# Altium project SwarmRobotPCB.PrjPcb
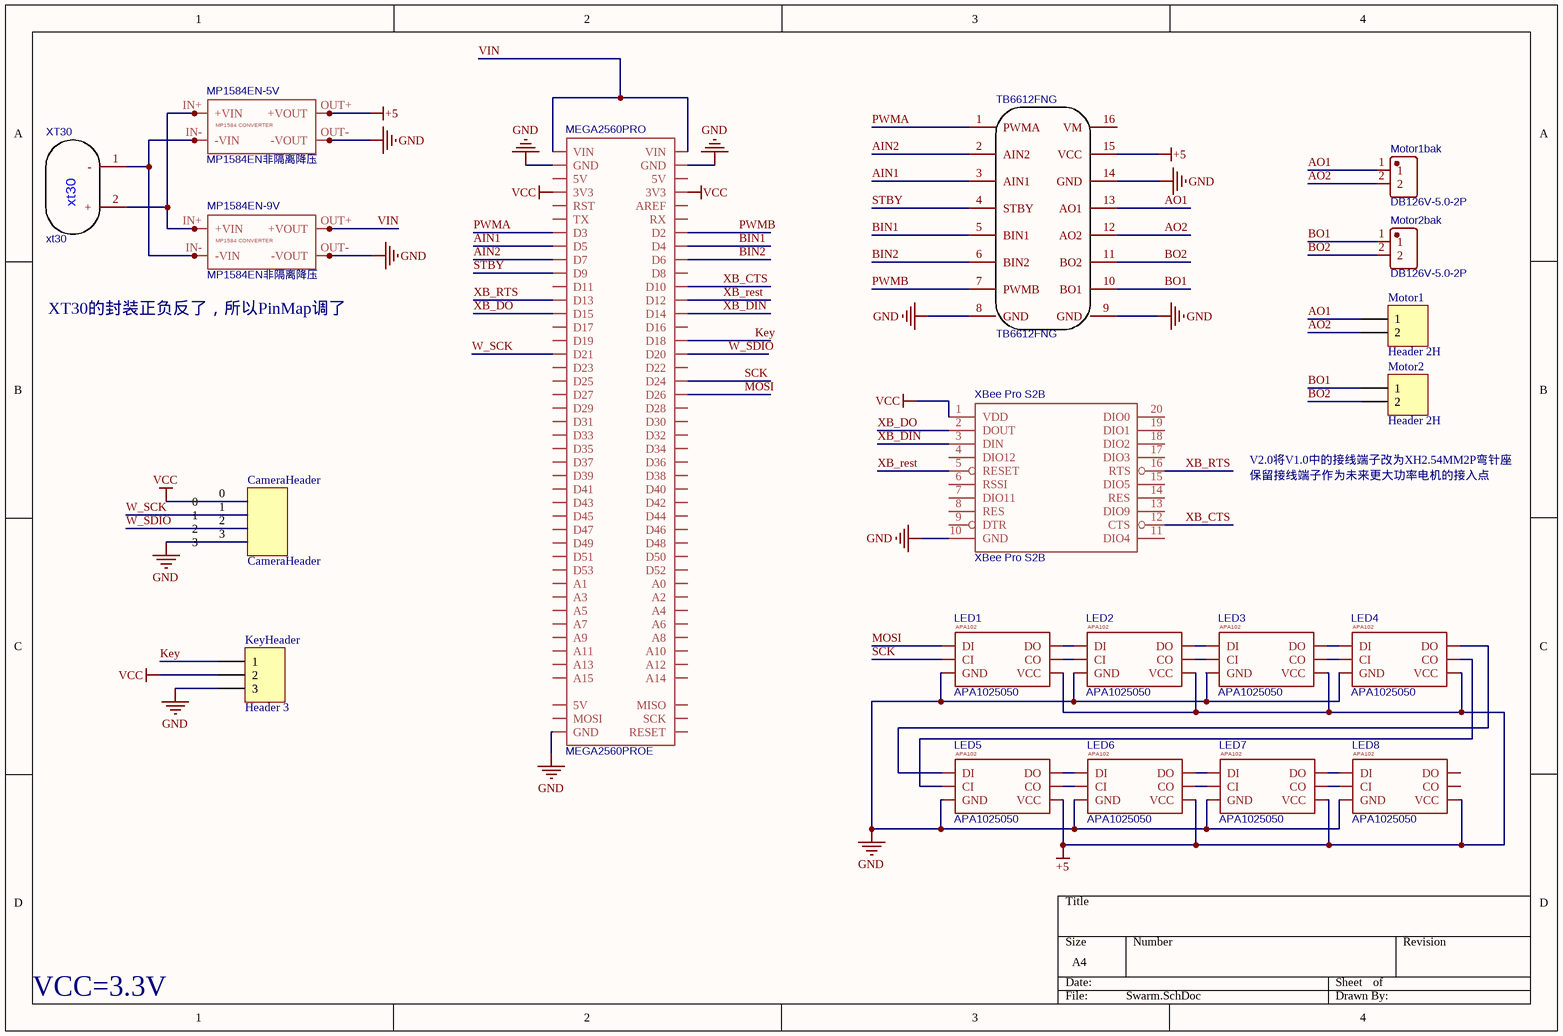
[diagram p0: Swarm.SchDoc]
1 sheet, 20 parts. Net scope: global (net labels, ports and power ports of the same name join across sheets).
Board file: Swarm.PcbDoc

## Sheet Swarm.SchDoc
size A4

### Parts
CameraHeader  CameraHeader  [CameraHeader]
KeyHeader  Header 3  [HDR1X3]
LED1  APA1025050  [APA102_5050]
LED2  APA1025050  [APA102_5050]
LED3  APA1025050  [APA102_5050]
LED4  APA1025050  [APA102_5050]
LED5  APA1025050  [APA102_5050]
LED6  APA1025050  [APA102_5050]
LED7  APA1025050  [APA102_5050]
LED8  APA1025050  [APA102_5050]
MEGA2560PRO  MEGA2560PROE  [MEGA2560PRO]
Motor1  Header 2H  [HDR1X2H]
Motor1bak  DB126V-5.0-2P  [CONN-TH_2PIN-V-PITCH5.00-L_JL126-50002G01]
Motor2  Header 2H  [HDR1X2H]
Motor2bak  DB126V-5.0-2P  [CONN-TH_2PIN-V-PITCH5.00-L_JL126-50002G01]
MP1584EN-5V  MP1584EN非隔离降压  [MP1584_DC]
MP1584EN-9V  MP1584EN非隔离降压  [MP1584_DC]
TB6612FNG  TB6612FNG  [TB6612FNG]
XBee_Pro_S2B  XBee Pro S2B  [XBEE-1]
XT30  xt30  [XT30 GONG]

### Nets
+5: LED1.1(VCC) LED2.1(VCC) LED3.1(VCC) LED4.1(VCC) LED5.1(VCC) LED6.1(VCC) LED7.1(VCC) LED8.1(VCC) MP1584EN-5V.OUT+(+VOUT) MP1584EN-5V.OUT+@1(+VOUT) TB6612FNG.15(VCC)
GND: CameraHeader.3 KeyHeader.3 LED1.6(GND) LED2.6(GND) LED3.6(GND) LED4.6(GND) LED5.6(GND) LED6.6(GND) LED7.6(GND) LED8.6(GND) MEGA2560PRO.GND@1(GND) MEGA2560PRO.GND@2(GND) MEGA2560PRO.GND@3(GND) MP1584EN-5V.OUT-(-VOUT) MP1584EN-5V.OUT-@1(-VOUT) MP1584EN-9V.OUT-(-VOUT) MP1584EN-9V.OUT-@1(-VOUT) TB6612FNG.8(GND) TB6612FNG.9(GND) TB6612FNG.14(GND) XBee_Pro_S2B.10(GND)
VCC: CameraHeader.0 KeyHeader.2 MEGA2560PRO.3V3@1(3V3) MEGA2560PRO.3V3@2(3V3) XBee_Pro_S2B.1(VDD)
AIN1: MEGA2560PRO.D5 TB6612FNG.3(AIN1)
AIN2: MEGA2560PRO.D7 TB6612FNG.2(AIN2)
AO1: Motor1.1 Motor1bak.1 TB6612FNG.13(AO1)
AO2: Motor1.2 Motor1bak.2 TB6612FNG.12(AO2)
BIN1: MEGA2560PRO.D4 TB6612FNG.5(BIN1)
BIN2: MEGA2560PRO.D6 TB6612FNG.6(BIN2)
BO1: Motor2.1 Motor2bak.1 TB6612FNG.10(BO1)
BO2: Motor2.2 Motor2bak.2 TB6612FNG.11(BO2)
Key: KeyHeader.1 MEGA2560PRO.D18
MOSI: LED1.4(DI) MEGA2560PRO.D26
PWMA: MEGA2560PRO.D3 TB6612FNG.1(PWMA)
PWMB: MEGA2560PRO.D2 TB6612FNG.7(PWMB)
SCK: LED1.5(CI) MEGA2560PRO.D24
STBY: MEGA2560PRO.D9 TB6612FNG.4(STBY)
VIN: MEGA2560PRO.VIN@1(VIN) MEGA2560PRO.VIN@2(VIN) MP1584EN-9V.OUT+(+VOUT) MP1584EN-9V.OUT+@1(+VOUT)
W_SCK: CameraHeader.1 MEGA2560PRO.D21
W_SDIO: CameraHeader.2 MEGA2560PRO.D20
XB_CTS: MEGA2560PRO.D10 XBee_Pro_S2B.12(CTS)
XB_DIN: MEGA2560PRO.D14 XBee_Pro_S2B.3(DIN)
XB_DO: MEGA2560PRO.D15 XBee_Pro_S2B.2(DOUT)
XB_rest: MEGA2560PRO.D12 XBee_Pro_S2B.5(RESET)
XB_RTS: MEGA2560PRO.D13 XBee_Pro_S2B.16(RTS)
NetLED1_2: LED1.2(CO) LED2.5(CI)
NetLED1_3: LED1.3(DO) LED2.4(DI)
NetLED2_2: LED2.2(CO) LED3.5(CI)
NetLED2_3: LED2.3(DO) LED3.4(DI)
NetLED3_2: LED3.2(CO) LED4.5(CI)
NetLED3_3: LED3.3(DO) LED4.4(DI)
NetLED4_2: LED4.2(CO) LED5.5(CI)
NetLED4_3: LED4.3(DO) LED5.4(DI)
NetLED5_2: LED5.2(CO) LED6.5(CI)
NetLED5_3: LED5.3(DO) LED6.4(DI)
NetLED6_2: LED6.2(CO) LED7.5(CI)
NetLED6_3: LED6.3(DO) LED7.4(DI)
NetLED7_2: LED7.2(CO) LED8.5(CI)
NetLED7_3: LED7.3(DO) LED8.4(DI)
NetMP1584EN-5V_IN+: MP1584EN-5V.IN+(+VIN) MP1584EN-5V.IN+@1(+VIN) MP1584EN-9V.IN+(+VIN) MP1584EN-9V.IN+@1(+VIN) XT30.2(+)
NetMP1584EN-5V_IN-: MP1584EN-5V.IN-(-VIN) MP1584EN-5V.IN-@1(-VIN) MP1584EN-9V.IN-(-VIN) MP1584EN-9V.IN-@1(-VIN) XT30.1(-)

Not connected (* = marked no-connect by the designer): LED8 2(CO) 3(DO); MEGA2560PRO 5V@1(5V) 5V@2(5V) 5V@3(5V) A0 A1 A2 A3 A4 A5 A6 A7 A8 A9 A10 A11 A12 A13 A14 A15 AREF D8 D11 D16 D17 D19 D22 D23 D25 D27 D28 D29 D30 D31 D32 D33 D34 D35 D36 D37 D38 D39 D40 D41 D42 D43 D44 D45 D46 D47 D48 D49 D50 D51 D52 D53 MISO MOSI RESET RST RX SCK TX; TB6612FNG 16(VM); XBee_Pro_S2B 4(DIO12) 6(RSSI) 7(DIO11) 8(RES) 9(DTR) 11(DIO4) 13(DIO9) 14(RES) 15(DIO5) 17(DIO3) 18(DIO2) 19(DIO1) 20(DIO0)

### Notes on the sheet
- (near MP1584EN-9V) XT30的封装正负反了，所以PinMap调了
- (near Motor2) V2.0将V1.0中的接线端子改为XH2.54MM2P弯针座
- 保留接线端子作为未来更大功率电机的接入点
- VCC=3.3V
- (in symbol APA1025050) APA102
- (in symbol MP1584EN非隔离降压) MP1584 CONVERTER

### Library data of the parts
CameraHeader = Component_1: pin to pad: 0>1 1>2 2>3 3>4
KeyHeader = Header 3: Header, 3-Pin; LatestRevisionDate: 17-Jul-2002; LatestRevisionNote: Re-released for DXP Platform.; Publisher: Altium Limited
MEGA2560PRO = MEGA2560PROE copy: Contributor: westcowboy; spicePre: M
Motor1 Motor2 = Header 2H: Header, 2-Pin, Right Angle; LatestRevisionDate: 17-Jul-2002; LatestRevisionNote: Re-released for DXP Platform.; Publisher: Altium Limited
Motor1bak Motor2bak = DB126V-5.0-2P: BOM_Manufacturer: DIBO; Contributor: LCSC; BOM_Supplier: LCSC; BOM_Supplier Part: C395849; BOM_Manufacturer Part: DB126V-5.0-2P; spicePre: U
MP1584EN-5V MP1584EN-9V = MP1584EN非隔离降压: Contributor: zuwenz; spicePre: D
TB6612FNG = TB6612FNG: Contributor: Lwj.bf; sourceId: YsmgyP7pj; timeStamp: 1453691199; spicePre: U
XBee_Pro_S2B = XBEE-1B1: Contributor: niudvb; spicePre: ?
XT30 = xt30: pin to pad: 1>2 2>1; Contributor: Weiwww; spicePre: U
LED1-LED8 = APA1025050: spicePre: U